# EasyEDA Pro project ProPrj_辉光管时钟V1.0_2025-10-09.epro, board PCB2
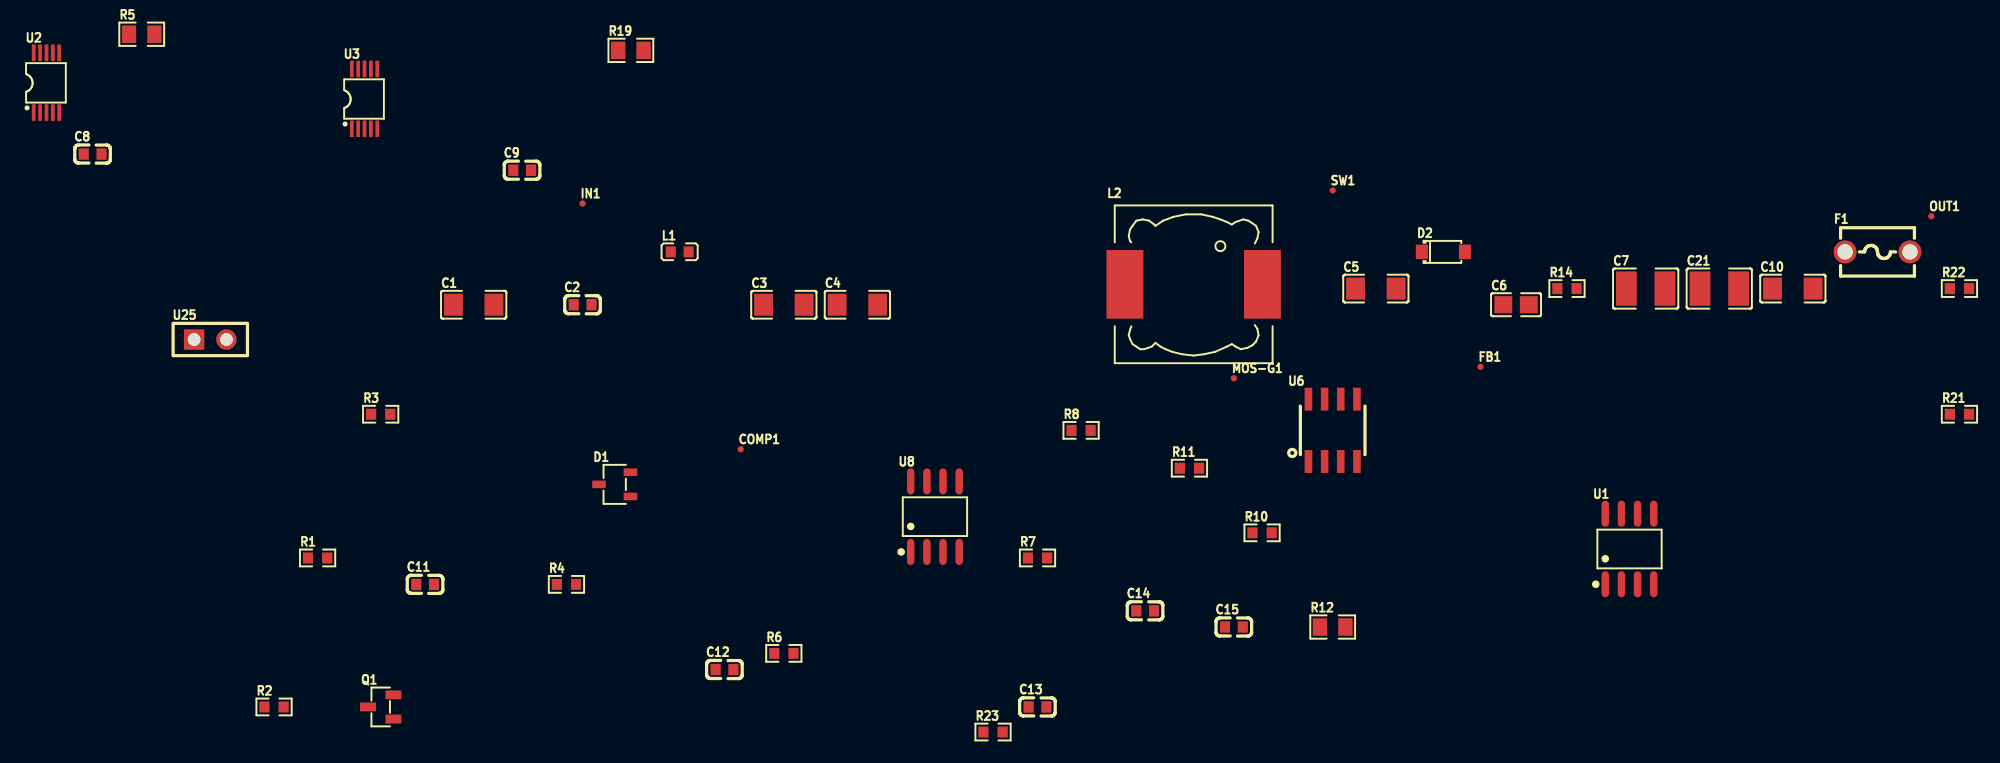
[diagram p8: board, top side]
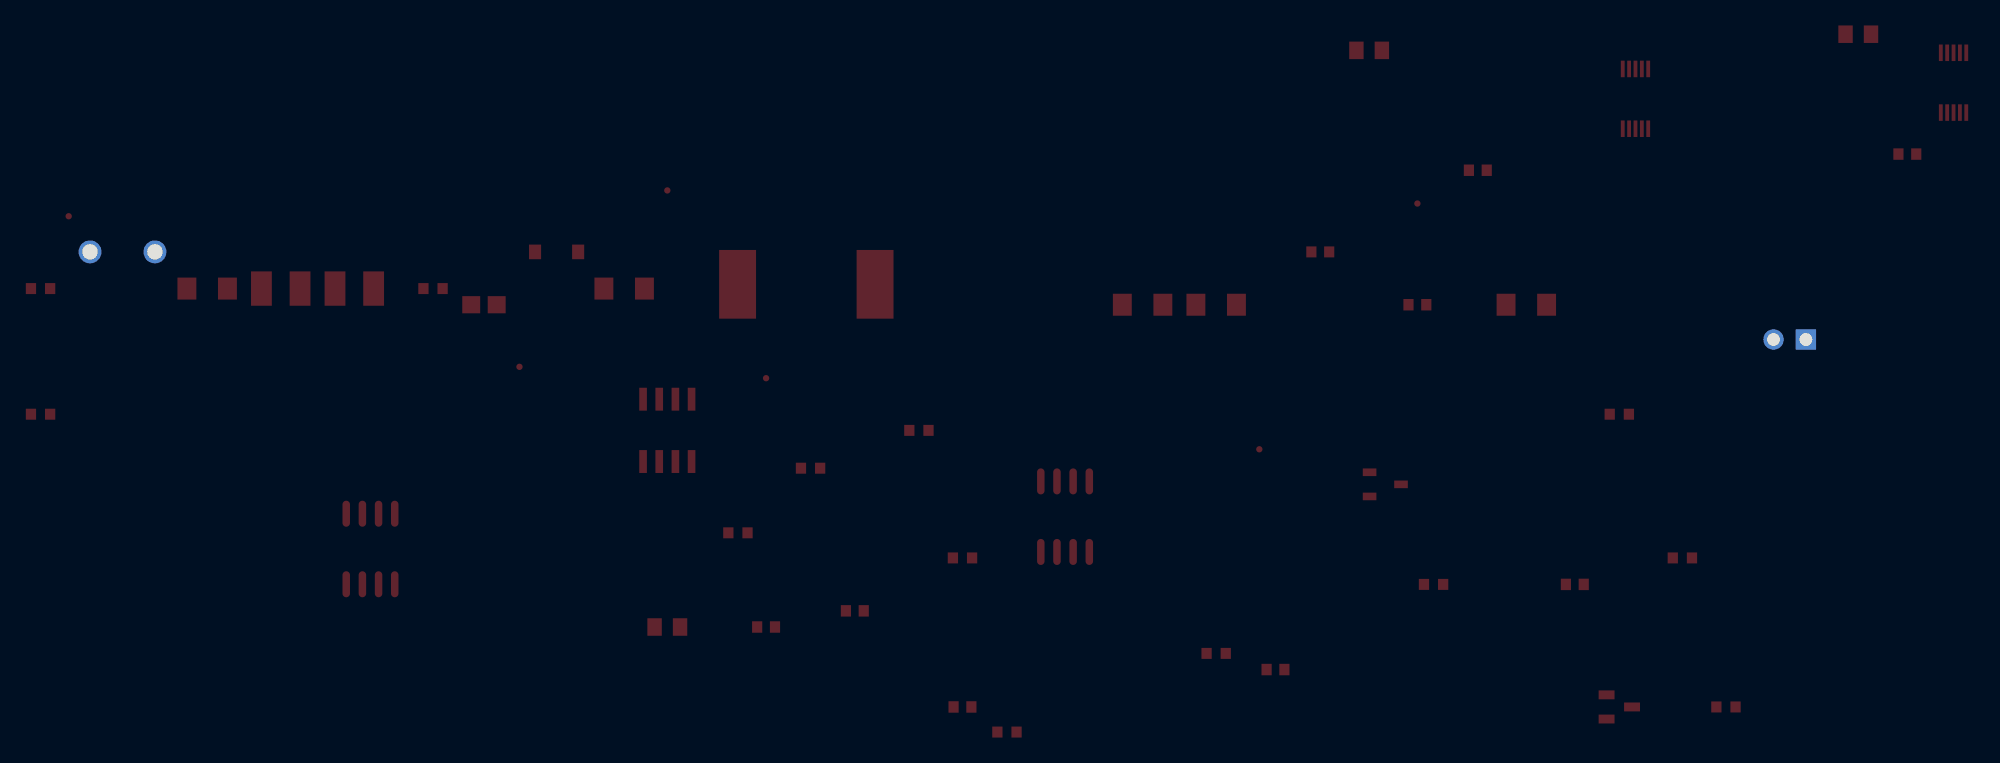
[diagram p9: board, bottom side, seen from below]

No outline. copper layers: Top Layer, Inner9, Inner10, Inner11, Inner12, Inner13, Inner14, Inner15, Inner16, Inner17, Inner18, Inner19, Inner20, Inner21, Inner22, Inner23, Inner24, Inner25, Inner26, Inner27, Inner28, Inner29, Inner30, Bottom Layer. Coordinates in mm from the lowest, leftmost part position.
Stack: Top Layer 0.035mm / Dielectric1 1.51mm FR4 er 4.5 / Bottom Layer 0.035mm

## Design rules (mm)
template: JLCPCB Capability(Two Layers Board)
spacing copperThickness1oz (default): track to track 0.102, other pairs 0.152 to 0.3
spacing copperThickness2oz: track to track 0.203, other pairs 0.152 to 0.3
track width copperThickness1oz (default): min 0.127, default 0.254, max 2.54
track width copperThickness2oz: min 0.203, default 0.254, max 2.54
differential pair differentialPair (default): width min 0.127, default 0.254, max 2.54; gap min 0.152, default 0.152
via viaSize (default): diameter min 0.5, default 0.61, max 10; hole min 0.3, default 0.305, max 6.3

## Placement (name value [footprint] x y rotation side)
C1  100uF  [c1206]  33.56 33.59 0 top
C2  0.1uF  [c0603]  42.12 33.59 0 top
C3  100uF  [c1206]  57.93 33.59 0 top
C4  100uF  [c1206]  63.7 33.59 0 top
C5  560pF  [c1206]  104.43 34.86 0 top
C6  100pF  [C0805]  115.44 33.59 0 top
C7  2.2uF  [c1210]  125.63 34.86 0 top
C8  0.1u  [C0603]  3.63 45.43 0 top
C9  0.1u  [C0603]  37.37 44.16 0 top
C10  0.1uF  [c1206]  137.19 34.86 0 top
C11  47uF  [c0603]  29.75 11.61 0 top
C12  220pF  [c0603]  53.27 4.91 0 top
C13  430pF  [c0603]  77.85 1.97 0 top
C14  0.1uF  [c0603]  86.31 9.53 0 top
C15  1nF  [c0603]  93.28 8.26 0 top
C21  2.2uF  [c1210]  131.41 34.86 0 top
COMP1  -  [Test-Point-0.5mm]  54.53 22.23 0 top
D1  BAT54C,215  [SOT-23-3_L2.9-W1.6-P1.90-LS2.8-BR]  44.64 19.47 0 top
D2  ES1J  [sod-123_l2.7-w1.6-ls3.6-rd]  109.74 37.74 0 top
F1  JK250-080U  [FUSE-TH_L5.8-W3.8-P5.10-D0.8]  143.84 37.74 0 top
FB1  -  [Test-Point-0.5mm]  112.66 28.71 0 top
IN1  -  [Test-Point-0.5mm]  42.12 41.54 0 top
L1  10uH  [l0603]  49.75 37.74 0 top
L2  33uH  [33uh功率电感]  90.12 35.19 0 top
MOS-G1  -  [Test-Point-0.5mm]  93.28 27.81 0 top
OUT1  -  [Test-Point-0.5mm]  148.07 40.54 0 top
Q1  MMBT5551  [SOT-23-3_L2.9-W1.3-P1.90-LS2.4-BR]  26.26 1.97 0 top
R1  100kΩ  [r0603]  21.3 13.69 0 top
R2  1kΩ  [r0603]  17.88 1.97 0 top
R3  2kΩ  [r0603]  26.26 24.98 0 top
R4  100kΩ  [r0603]  40.85 11.61 0 top
R5  10mΩ  [R0805]  7.48 54.85 0 top
R6  10KΩ  [r0603]  57.93 6.18 0 top
R7  60.4kΩ  [r0603]  77.85 13.69 0 top
R8  2Ω  [r0603]  81.28 23.71 0 top
R10  10kΩ  [r0603]  95.49 15.66 0 top
R11  51KΩ  [r0603]  89.79 20.74 0 top
R12  100mΩ  [R0805]  101.04 8.26 0 top
R14  400kΩ  [r0603]  119.45 34.86 0 top
R19  100mΩ  [R0805]  45.91 53.58 0 top
R21  1MΩ  [r0603]  150.28 24.98 0 top
R22  9.1MΩ  [r0603]  150.28 34.86 0 top
R23  5KΩ  [r0603]  74.36 0 0 top
SW1  -  [Test-Point-0.5mm]  101.04 42.57 0 top
U1  MCP41010T-I/SN  [SOIC-8_L4.9-W3.9-P1.27-LS6.0-BL]  124.36 14.39 0 top
U2  INA220AIDGSR  [VSSOP-10_L3.0-W3.0-P0.50-LS4.9-BL]  0 51.04 0 top
U3  INA220AIDGSR  [VSSOP-10_L3.0-W3.0-P0.50-LS4.9-BL]  24.99 49.77 0 top
U6  FDS2672  [SO-8_L4.9-W3.9-P1.27-LS6.0-BL]  101.04 23.71 0 top
U8  UCC3803D  [SOIC-8_L4.9-W3.9-P1.27-LS6.0-BL]  69.8 16.93 0 top
U25  -  [2.54mm1*2]  12.87 30.85 0 top

## Footprints (pads in the part's own frame, mm; a bottom-side part is the same pattern mirrored in y, then rotated)
2.54mm1*2
  rect 1.6x1.6 hole 1: 1(-1.27,0)
  round 1.6 hole 1: 2(1.27,0)
33uh功率电感
  rect 2.9x5.4 smd: 1(5.4,0) 2(-5.4,0)
C0603
  rect 0.8x0.9 smd: 1(-0.7,0) 2(0.7,0)
c0603
  rect 0.8x0.9 smd: 1(-0.7,0) 2(0.7,0)
C0805
  rect 1.41x1.35 smd: 1(-1,0) 2(1,0)
c1206
  rect 1.485x1.728 smd: 1(-1.593,0) 2(1.593,0)
c1210
  rect 1.635x2.7 smd: 1(-1.518,0) 2(1.518,0)
FUSE-TH_L5.8-W3.8-P5.10-D0.8
  round 1.8 hole 1.2: 1(-2.55,0) 2(2.55,0)
l0603
  rect 0.8x0.864 smd: 1(-0.7,0) 2(0.7,0)
r0603
  rect 0.806x0.864 smd: 1(-0.753,0) 2(0.753,0)
R0805
  rect 1.133x1.377 smd: 1(-1,0) 2(1,0)
SO-8_L4.9-W3.9-P1.27-LS6.0-BL
  rect 0.6x1.8 smd: 1(-1.905,-2.45) 2(-0.635,-2.45) 3(0.635,-2.45) 4(1.905,-2.45) 5(1.905,2.45) 6(0.635,2.45) 7(-0.635,2.45) 8(-1.905,2.45)
sod-123_l2.7-w1.6-ls3.6-rd
  rect 0.95x1.15 smd: 1(-1.692,0) 2(1.692,0)
SOIC-8_L4.9-W3.9-P1.27-LS6.0-BL
  oval 0.588x2.045 smd: 1(-1.905,-2.772) 2(-0.635,-2.772) 3(0.635,-2.772) 4(1.905,-2.772) 5(1.905,2.772) 6(0.635,2.772) 7(-0.635,2.772) 8(-1.905,2.772)
SOT-23-3_L2.9-W1.3-P1.90-LS2.4-BR
  rect 1.25x0.7 smd: 1(1,-0.95) 2(1,0.95) 3(-1,0)
SOT-23-3_L2.9-W1.6-P1.90-LS2.8-BR
  rect 1.07x0.6 smd: 1(1.235,-0.95) 2(1.235,0.95) 3(-1.235,0)
Test-Point-0.5mm
  round 0.5 smd: 1(0,0)
VSSOP-10_L3.0-W3.0-P0.50-LS4.9-BL
  rect 0.3x1.3 smd: 1(-1,-2.35) 2(-0.5,-2.35) 3(0,-2.35) 4(0.5,-2.35) 5(1,-2.35) 6(1,2.35) 7(0.5,2.35) 8(0,2.35) 9(-0.5,2.35) 10(-1,2.35)

## Nets
As in the schematic, except:
SCL: U2.5 U3.5
SDA: U2.4 U3.4

Pads without a net: D1 2; U2 3; U3 3
